# Altium project simple music keyboard.PrjPcb
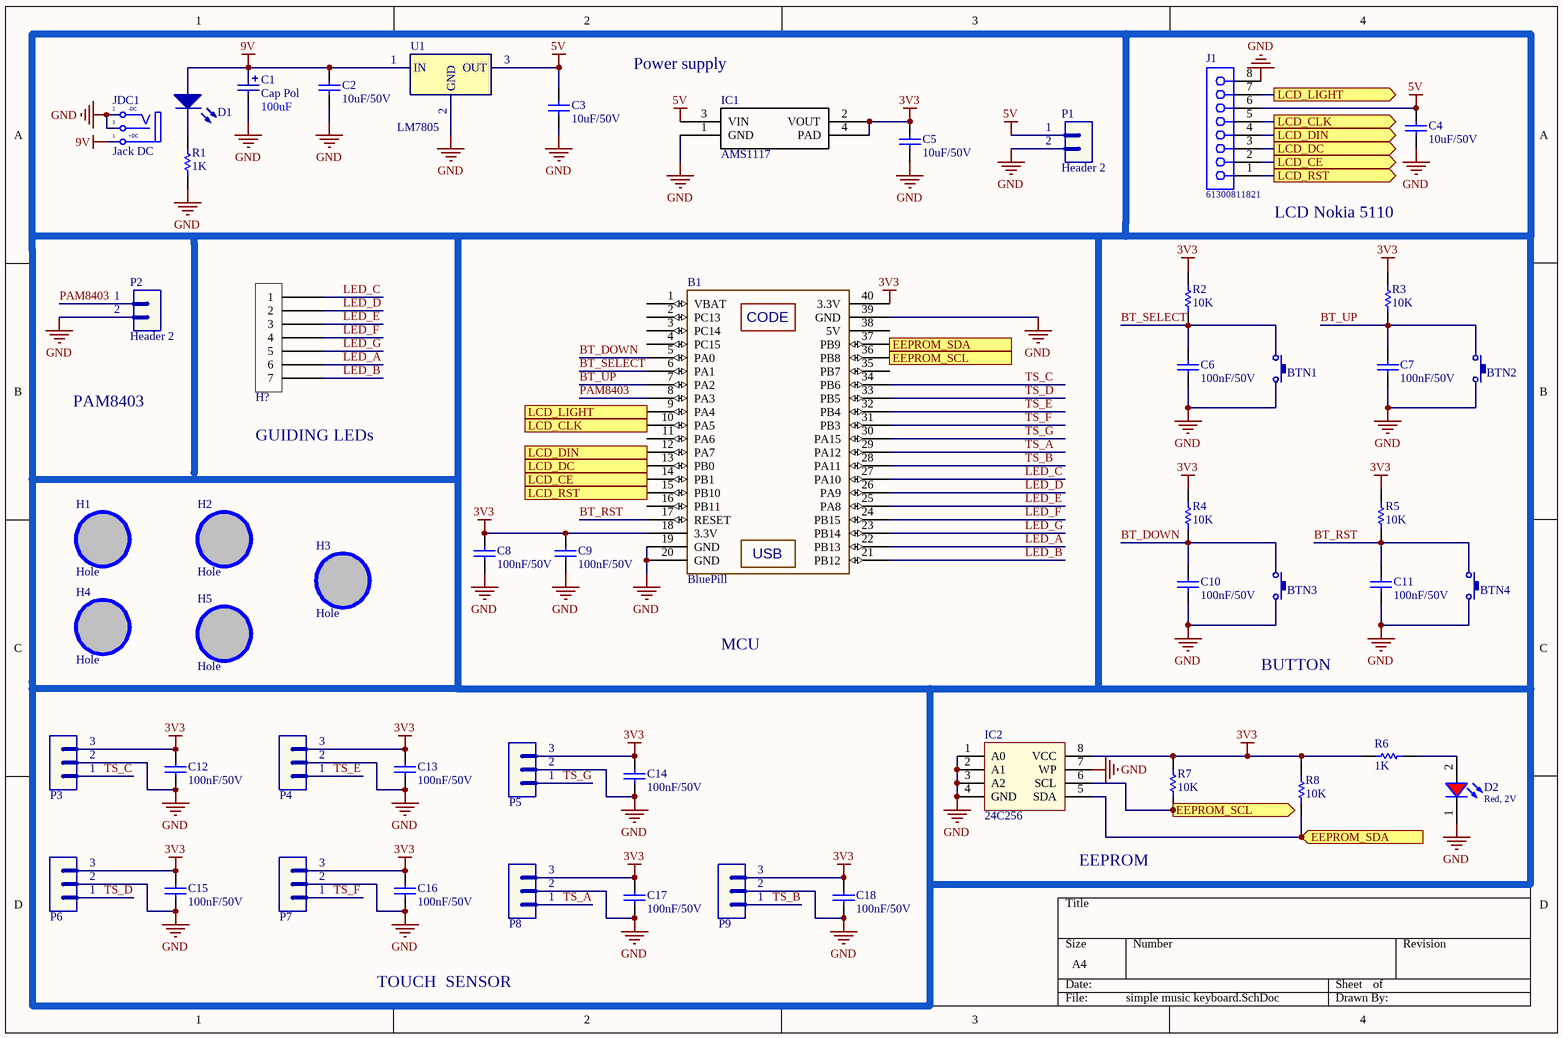
[diagram p0: simple music keyboard.SchDoc]
1 sheet, 53 parts. Net scope: flat (ports and power ports of the same name join across sheets).
Board file: simple music keyboard.PcbDoc

## Sheet simple music keyboard.SchDoc
size A4

### Parts
B1  BluePill  [BlUEPILL]
BTN1  Button  [Button]  (value not drawn)
BTN2  Button  [Button]  (value not drawn)
BTN3  Button  [Button]  (value not drawn)
BTN4  Button  [Button]  (value not drawn)
C1  Cap Pol  value 100uF  [CP1/2]
C2  value 10uF/50V  [CAP-SM-0805]  (hidden comment: Cap-10uF-50V-0805)
C3  value 10uF/50V  [CAP-SM-0805]  (hidden comment: Cap-10uF-50V-0805)
C4  value 10uF/50V  [CAP-SM-0805]  (hidden comment: Cap-10uF-50V-0805)
C5  value 10uF/50V  [CAP-SM-0805]  (hidden comment: Cap-10uF-50V-0805)
C6  value 100nF/50V  [CAP-SM-0805]  (hidden comment: Cap-100nF-50V-0805)
C7  value 100nF/50V  [CAP-SM-0805]  (hidden comment: Cap-100nF-50V-0805)
C8  value 100nF/50V  [CAP-SM-0805]  (hidden comment: Cap-100nF-50V-0805)
C9  value 100nF/50V  [CAP-SM-0805]  (hidden comment: Cap-100nF-50V-0805)
C10  value 100nF/50V  [CAP-SM-0805]  (hidden comment: Cap-100nF-50V-0805)
C11  value 100nF/50V  [CAP-SM-0805]  (hidden comment: Cap-100nF-50V-0805)
C12  value 100nF/50V  [CAP-SM-0805]  (hidden comment: Cap-100nF-50V-0805)
C13  value 100nF/50V  [CAP-SM-0805]  (hidden comment: Cap-100nF-50V-0805)
C14  value 100nF/50V  [CAP-SM-0805]  (hidden comment: Cap-100nF-50V-0805)
C15  value 100nF/50V  [CAP-SM-0805]  (hidden comment: Cap-100nF-50V-0805)
C16  value 100nF/50V  [CAP-SM-0805]  (hidden comment: Cap-100nF-50V-0805)
C17  value 100nF/50V  [CAP-SM-0805]  (hidden comment: Cap-100nF-50V-0805)
C18  value 100nF/50V  [CAP-SM-0805]  (hidden comment: Cap-100nF-50V-0805)
D1  LED  [LED-5mm]  (value not drawn)
D2  Red, 2V  [WL-SMCW_0805]
H1  Hole  [LO KHOAN 3MM]
H2  Hole  [LO KHOAN 3MM]
H3  Hole  [LO KHOAN 3MM]
H4  Hole  [LO KHOAN 3MM]
H5  Hole  [LO KHOAN 3MM]
IC1  AMS1117  [SOT223_AMS111700]
IC2  24C256  [DIP8/W0.3]
J1  61300811821  [61300811821]
JDC1  Jack DC  [JACK-DC]
P1  Header 2  [JP2]
P2  Header 2  [JP2]
P3  Header 3  [JP3]  (value not drawn)
P4  Header 3  [JP3]  (value not drawn)
P5  Header 3  [JP3]  (value not drawn)
P6  Header 3  [JP3]  (value not drawn)
P7  Header 3  [JP3]  (value not drawn)
P8  Header 3  [JP3]  (value not drawn)
P9  Header 3  [JP3]  (value not drawn)
R1  value 1K  [RES-SM-0805]  (hidden comment: Res-1K-0805)
R2  value 10K  [RES-SM-0805]  (hidden comment: Res-10k-0805)
R3  value 10K  [RES-SM-0805]  (hidden comment: Res-10k-0805)
R4  value 10K  [RES-SM-0805]  (hidden comment: Res-10k-0805)
R5  value 10K  [RES-SM-0805]  (hidden comment: Res-10k-0805)
R6  value 1K  [RES-SM-0805]  (hidden comment: Res-1K-0805)
R7  value 10K  [RES-SM-0805]  (hidden comment: Res-10k-0805)
R8  value 10K  [RES-SM-0805]  (hidden comment: Res-10k-0805)
U1  LM7805  [QTO-220]
XH_B1  H?  [XH B7B]

### Ports
EEPROM_SCL (out), EEPROM_SDA (in), LCD_CE (out), LCD_CLK (out), LCD_DC (out), LCD_DIN (out), LCD_LIGHT (out), LCD_RST (out)

### Nets
3V3: B1.18(3.3V) B1.40(3.3V) C5.2 C8.2 C9.2 C12.2 C13.2 C14.2 C15.2 C16.2 C17.2 C18.2 IC1.2(VOUT) IC1.4(PAD) IC2.8(VCC) P3.3 P4.3 P5.3 P6.3 P7.3 P8.3 P9.3 R2.2 R3.2 R4.2 R5.2 R6.1 R7.2 R8.2
5V: C3.2 C4.2 IC1.3(VIN) J1.6 P1.1 U1.3(OUT)
9V: C1.1 C2.2 D1.1(A) JDC1.1(T) U1.1(IN)
GND: B1.19(GND) B1.20(GND) B1.39(GND) BTN1.2 BTN2.2 BTN3.2 BTN4.2 C1.2 C2.1 C3.1 C4.1 C5.1 C6.1 C7.1 C8.1 C9.1 C10.1 C11.1 C12.1 C13.1 C14.1 C15.1 C16.1 C17.1 C18.1 D2.1(K) IC1.1(GND) IC2.1(A0) IC2.2(A1) IC2.3(A2) IC2.4(GND) IC2.7(WP) J1.8 JDC1.2(TN) JDC1.3(S) P1.2 P2.2 P3.2 P4.2 P5.2 P6.2 P7.2 P8.2 P9.2 R1.1 U1.2(GND)
BT_DOWN: B1.5(PA0) BTN3.1 C10.2 R4.1
BT_RST: B1.17(RESET) BTN4.1 C11.2 R5.1
BT_SELECT: B1.6(PA1) BTN1.1 C6.2 R2.1
BT_UP: B1.7(PA2) BTN2.1 C7.2 R3.1
LED_A: B1.22(PB13) XH_B1.6
LED_B: B1.21(PB12) XH_B1.7
LED_C: B1.27(PA10) XH_B1.1
LED_D: B1.26(PA9) XH_B1.2
LED_E: B1.25(PA8) XH_B1.3
LED_F: B1.24(PB15) XH_B1.4
LED_G: B1.23(PB14) XH_B1.5
PAM8403: B1.8(PA3) P2.1
TS_A: B1.29(PA12) P8.1
TS_B: B1.28(PA11) P9.1
TS_C: B1.34(PB6) P3.1
TS_D: B1.33(PB5) P6.1
TS_E: B1.32(PB4) P4.1
TS_F: B1.31(PB3) P7.1
TS_G: B1.30(PA15) P5.1
NetB1_9: B1.9(PA4) J1.7 ; port LCD_LIGHT
NetB1_10: B1.10(PA5) J1.5 ; port LCD_CLK
NetB1_12: B1.12(PA7) J1.4 ; port LCD_DIN
NetB1_13: B1.13(PB0) J1.3 ; port LCD_DC
NetB1_14: B1.14(PB1) J1.2 ; port LCD_CE
NetB1_15: B1.15(PB10) J1.1 ; port LCD_RST
NetB1_36: B1.36(PB8) IC2.6(SCL) R7.1 ; port EEPROM_SCL
NetB1_37: B1.37(PB9) IC2.5(SDA) R8.1 ; port EEPROM_SDA
NetD1_2: D1.2(K) R1.2
NetD2_2: D2.2(A) R6.2

Not connected (* = marked no-connect by the designer): B1 1(VBAT) 2(PC13) 3(PC14) 4(PC15) 11(PA6) 16(PB11) 35(PB7) 38(5V); H1 1; H2 1; H3 1; H4 1; H5 1

### Notes on the sheet
- (near IC1) Power supply
- LCD Nokia 5110
- PAM8403
- (near XH_B1) GUIDING LEDs
- MCU
- BUTTON
- EEPROM
- TOUCH  SENSOR
- (in symbol BluePill) CODE; USB
- (in symbol Jack DC) -DC; +DC

### Library data of the parts
C1 = Cap Pol: Polarized Capacitor (Radial)
C2-C5 = Cap-10uF-50V-0805: CAP CER 10UF 50V X5R 0805; Manufacturer: Yageo; Manufacturer Part Number: CC0805KKX5R9BB106; Local Supplier: thegioiic; Local Supplier Link: https://thegioiic.com/products/tu-10uf-50v-0805; Supplier 1: Digikey; Supplier 1 Link: https://www.digikey.com/product-detail/en/yageo/CC0805KKX5R9BB106/311-3499-2-ND/7164383; Supplier 1 Part Number: 311-3499-2-ND
C6-C18 = Cap-100nF-50V-0805: CAP CER 0.1UF 50V Y5V 0805; Manufacturer: Samsung Electro-Mechanics; Manufacturer Part Number: CL21F104ZBCNNNC; Local Supplier: thegioiic; Local Supplier Link: https://thegioiic.com/products/tu-100nf-0-1uf-50v-0805; Supplier 1: Digikey; Supplier 1 Part Number: 1276-1007-1-ND; Supplier 1 Link: https://www.digikey.com/product-detail/en/samsung-electro-mechanics/CL21F104ZBCNNNC/1276-1007-1-ND/3889093
D2 = 150080RS75000: WL-SMCW SMT Mono-color Chip LED Waterclear, size 0805, Red, 2V, 140deg; Chip Technology: AlInGaP; Dominant Wavelength typ.: 625nm; Luminous Intensity typ.: 150mcd; Peak Wavelength typ.: 630nm; Viewing Angle: 140deg; ComponentLink1Description: Manufacturer; ComponentLink1URL: http://www.we-online.de; ComponentLink2URL: https://www.we-online.com/catalog/datasheet/150080RS75000.pdf; ComponentLink2Description: Datasheet; Forward Voltage typ.: 2V; Emitting Color: Red; Mounting Technology: SMT; Operating Temperature: -40 to +85degC; Published Date: December 2019; Part Number: 150080RS75000; Packaging: Tape and Reel; Size: 0805; Publisher: Wurth Elektronik
H1-H5 = Hole: Hole 3mm
IC1 = AMS1117: Manufacturer_Part_Number: AMS1117-5.0; SourceLibrary: Advanced_Monolithic_Systems_2020-02-13; Built_By: EMA_Kyle; Vendor: Advanced Monolithic Systems; Copyright: Copyright (C) 2018 Accelerated Designs. All rights reserved; RefDes: RefDes; Type: DEV
IC2 = 24Cxx_MH: Dán; Ten_Linh_Kien: AT24C01 DIP8 EEPROM 1KBIT; Ma_Hang: MH002775; Don_Vi: Con; Kieu_Chan: *; Ghi_Chu: *; Chung_Loai: Dán
J1 = 61300811821: WR-PHD Socket Header, THT, pitch 2.54mm, Single Row, Vertical, 8p; Manufacturer: Wurth Elektronik; Pin Number: 8; Rated Current: 3A; Working Voltage: 250VAC; Withstanding Voltage: 500VAC; Contact Resistance: 20mOhm; ComponentLink1Description: Manufacturer; ComponentLink1URL: http://www.we-online.de; ComponentLink2Description: Datasheet; ComponentLink2URL: https://www.we-online.com/catalog/datasheet/61300811821.pdf; Manufacturer Part Number: 61300811821; Published Date: May 2020; Pitch: 2.54mm; Operating Temperature: -40 to +125degC; Mounting Technology: THT; Packaging: Tray; Gender: Socket Header; Row Number: Single; Orientation: Vertical
JDC1 = Jack DC: Jack DC input; Value: Jac DC
P1 P2 = Header 2: Header, 2-Pin; LatestRevisionDate: 17-Jul-2002; LatestRevisionNote: Re-released for DXP Platform.; Publisher: Altium Limited
P3-P9 = Header 3: Header, 3-Pin; LatestRevisionDate: 17-Jul-2002; LatestRevisionNote: Re-released for DXP Platform.; Publisher: Altium Limited
R1 R6 = Res-1K-0805: RES 1K OHM 1% 1/4W 0805; Manufacturer: Stackpole Electronics Inc; Manufacturer Part Number: RNCP0805FTD1K00; Local Supplier: thegioiic; Local Supplier Link: https://thegioiic.com/products/dien-tro-1k-ohm-0805-5; Supplier 1: Digikey; Supplier 1 Link: https://www.digikey.com/product-detail/en/stackpole-electronics-inc/RNCP0805FTD1K00/RNCP0805FTD1K00CT-ND/2240568; Supplier 1 Part Number: RNCP0805FTD1K00CT-ND
R2-R5 R7 R8 = Res-10k-0805: RES 10K OHM 1% 1/4W 0805; Manufacturer: Stackpole Electronics Inc; Manufacturer Part Number: RNCP0805FTD10K0; Local Supplier: thegioiic; Local Supplier Link: https://thegioiic.com/products/dien-tro-10k-ohm-0805-5; Supplier 1: Digikey; Supplier 1 Link: https://www.digikey.com/product-detail/en/stackpole-electronics-inc/RNCP0805FTD10K0/RNCP0805FTD10K0CT-ND/2240601; Supplier 1 Part Number: RNCP0805FTD10K0CT-ND
U1 = LM7805: Positive Voltage Regulator
XH_B1 = XH B7B